# EAGLE design Rocket-Switch-Interface_1.0 (EAGLE 9.6.2)
AUTHOR: ladyada
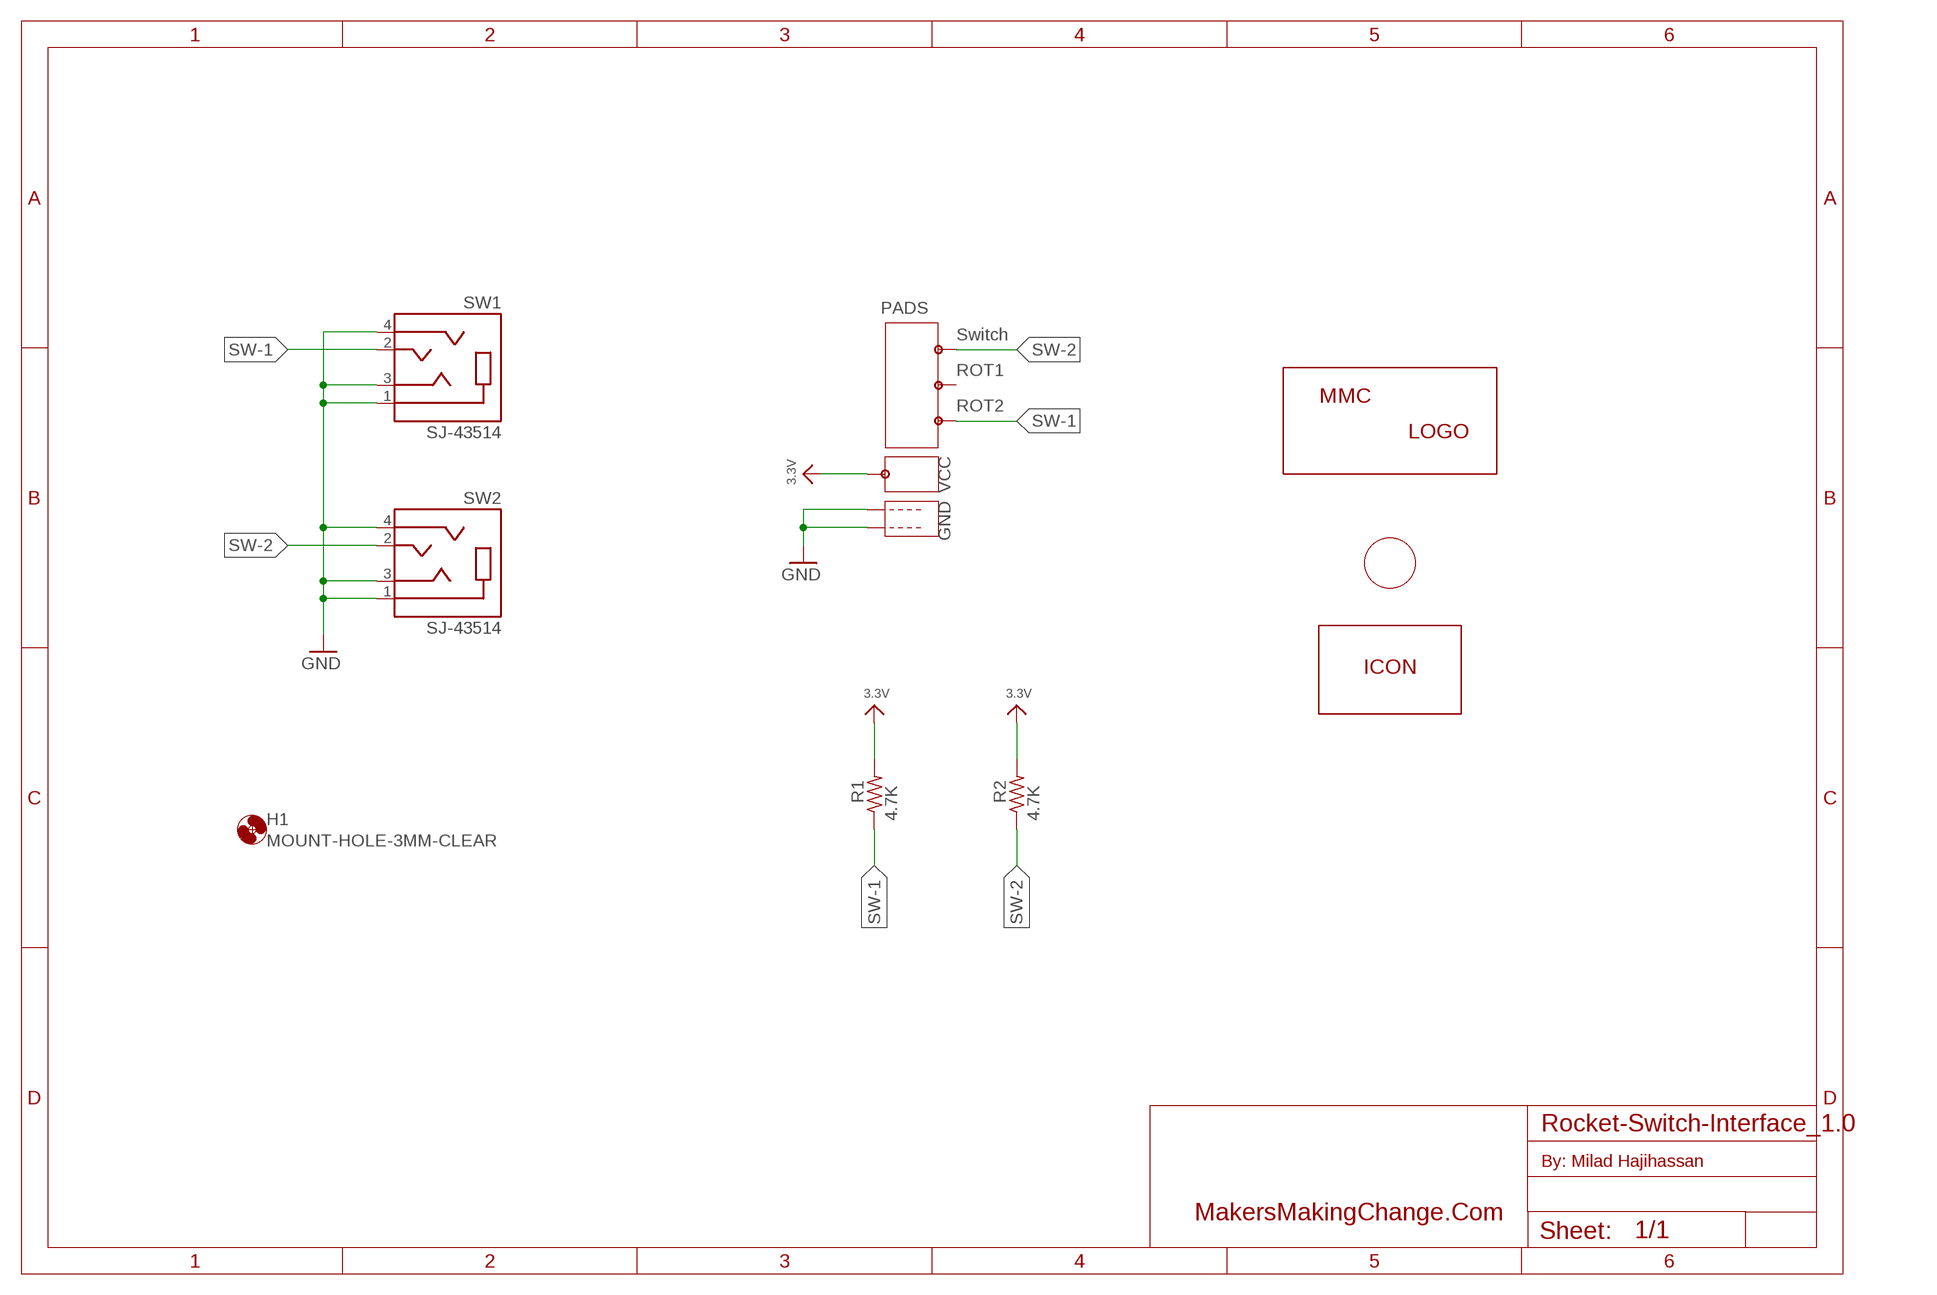
[diagram p0: schematic, sheet 1]

## Parts
H1  MOUNT-HOLE-3MM-CLEAR  [HOLE-3MM-CLEAR]
LABEL_BACKGROUND  MMC_ICON-ROCKET-SW  [ICON_ROCKET-SWITCH]
LABEL_DEVICE  MMC_LABEL-ROCKET-SW  [LABEL-ROCKET-SWITCH]
LABEL_LOGO  MMC_LOGO-XSM  [MMC_X-SMALL_LOGO]
PADS  PADS-ROTARY-TRINKEY  [PADS-ROTARY-TRINKEY]
R1  4.7K  RESISTOR-US-0204/5  [RESISTOR_0204/5]
R2  4.7K  RESISTOR-US-0204/5  [RESISTOR_0204/5]
SW1  SJ-43514  [CUI_SJ-43514]
SW2  SJ-43514  [CUI_SJ-43514]

## Nets
3.3V: PADS.P$VCC R1.2 R2.2
GND: PADS.P$GND1 PADS.P$GND2 SW1.1(SLEEVE) SW1.3(RING1) SW1.4(RING2) SW2.1(SLEEVE) SW2.3(RING1) SW2.4(RING2)
SW-1: PADS.P$ROT2 R1.1 SW1.2(TIP)
SW-2: PADS.P$SW R2.1 SW2.2(TIP)
Unconnected: PADS.P$ROT1

## Notes on the sheet
- By: Milad Hajihassan
- MakersMakingChange.Com

## Library data of the parts
H1 = MMC Eagle:MOUNT-HOLE-: MOUNTING HOLE with drill center marker
LABEL_BACKGROUND = MMC Eagle:MMC_ICON-
LABEL_DEVICE = MMC Eagle:MMC_LABEL-
LABEL_LOGO = MMC Eagle:MMC_LOGO-
PADS = MMC Eagle:PADS-ROTARY-TRINKEY: Rotary Encoder with Built-In Switch PEC11 - 24 Step, PEC11-4215F-S24 - http://www.adafruit.com/products/377
R1 R2 = MMC Eagle:RESISTOR-US-: RESISTOR, American symbol
SW1 SW2 = MMC Eagle:SJ-43514: SJ-43514 3.50mm (0.141", 1/8", Mini Plug) - Headphone Phone Jack Stereo (4 Conductor, TRRS) Connector. You can use these as jacks to connect analog joysticks or create simple switch interfaces. Options: Digikey - CP-43514-ND <https://www.digikey.ca/en/products/detail/cui-devices/SJ-43514/368146> Mouser - 490-SJ-43514 <https://www.mouser.ca/ProductDetail/CUI-Devices/SJ-43514?qs=WyjlAZoYn51bsBOfuwwiuw%3D%3D>

## Board
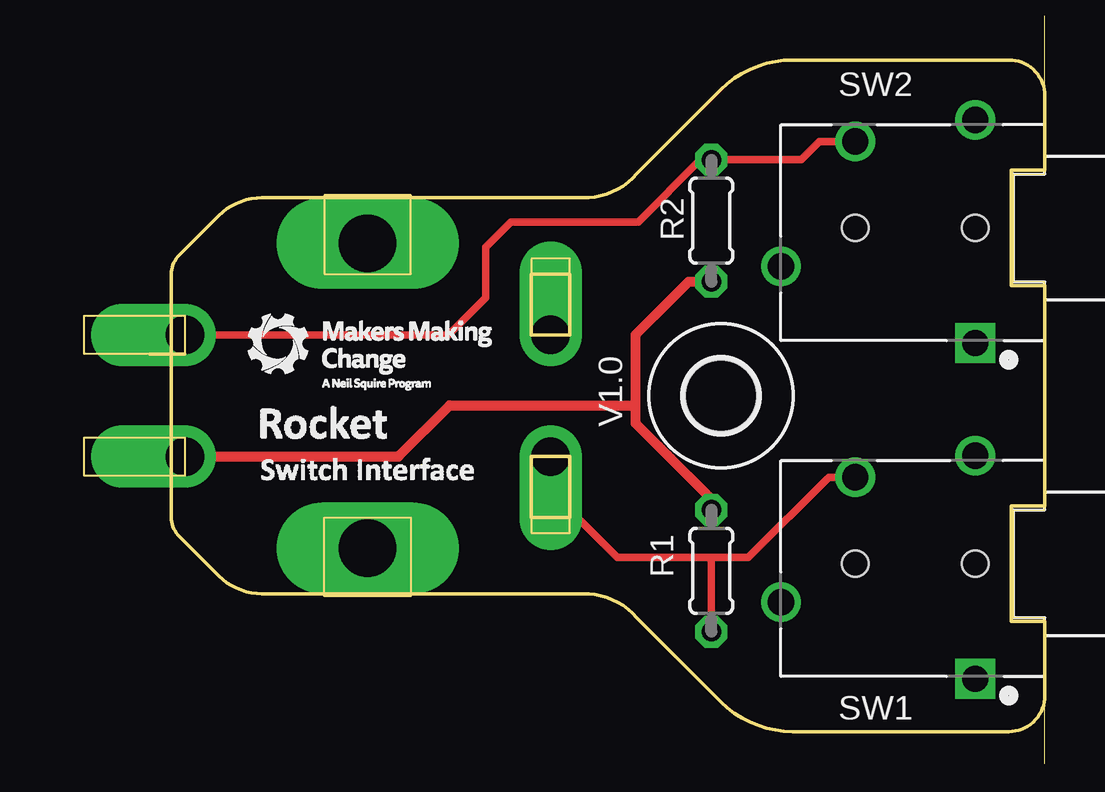
[diagram p1: board, top side]
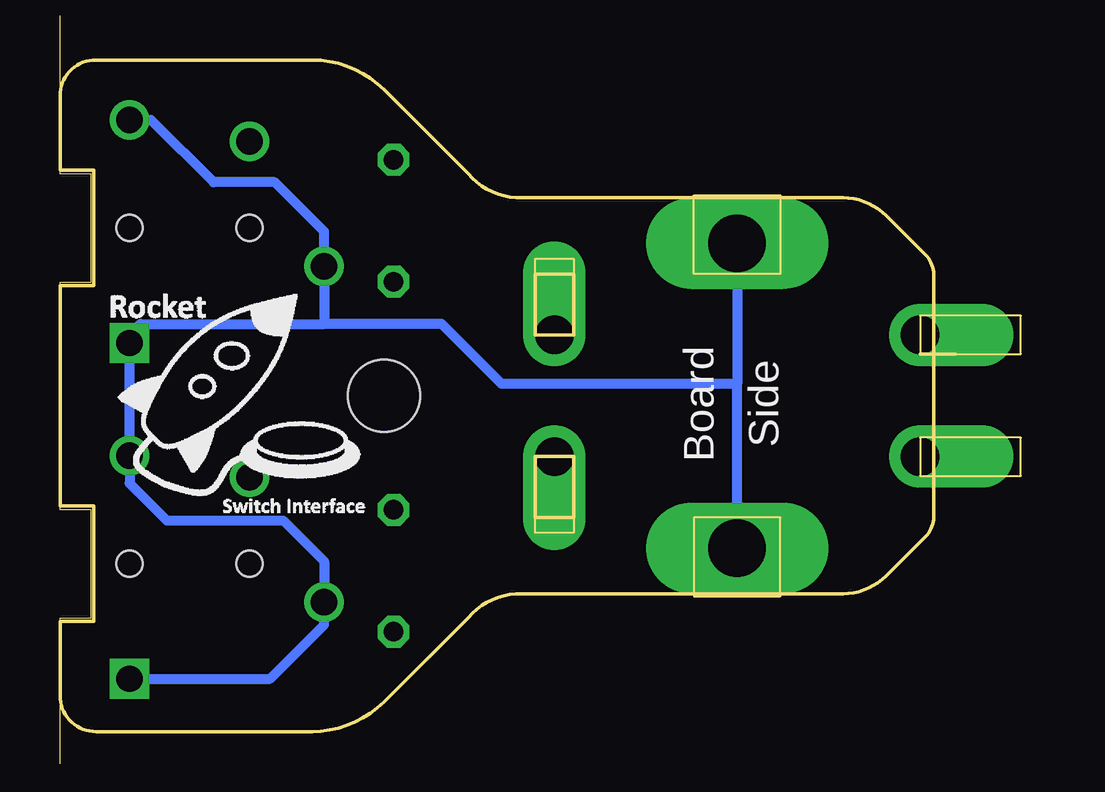
[diagram p2: board, bottom side, seen from below]

Size 37.3 x 28 mm. Coordinates in mm from the lower left corner, seen from the top.
Outline: 0,15.74 1.46,15.74
Outline: 1.17,19.8 1.4,20.03 2.88,21.51 arc-45 4.67,22.25 18.3,22.25 arc45 20.3,23.25 23.8,26.75 arc-45 26.8,28 35.8,28 arc-90 37.3,26.5 37.3,23.4 35.9,23.4 35.9,18.6 37.3,18.6 37.3,9.4 35.9,9.4 35.9,4.6 37.3,4.6 37.3,1.5 arc-90 35.8,0 26.8,0 arc-45 23.8,1.25 20.3,4.75 arc45 18.3,5.75 4.67,5.75 arc-45 2.88,6.49 1.4,7.97 1.17,8.2 arc-35 0.9,8.85 0.9,19.15 arc-35 1.17,19.8
Outline: 15.9,8.92 15.9,11.46 17.5,11.46 17.5,8.92 15.9,8.92
Outline: 15.9,16.54 15.9,19.08 17.5,19.08 17.5,16.54 15.9,16.54
Copper layers (1*16): Top 0.035mm / dielectric 1.5mm / Bottom 0.035mm
Design rules "adafruit 8-8 *": minimum track width 8mil, minimum drill 15.5mil, track to track 8mil, track to pad 8mil, pad to pad 8mil, via to via 8mil, smd to smd 8mil, copper to edge 10mil, drill to drill 8mil, minimum pad ring 10mil, minimum via ring 8mil, stop-mask expansion 2mil, vias tented up to drill 20mil, thermal gap 10mil

### Footprints (pad centres in the part's own frame; a part is rotated, then mirrored left to right if it is on the bottom)
HOLE-3MM-CLEAR = hole 3: 0,0
PADS-ROTARY-TRINKEY = drill 2.4 pad 3.8 long: P$GND1 -6.35,0; P$GND2 6.35,0 | drill 1.6 pad 2.6 offset: P$ROT1 2.54,-7.62; P$ROT2 -2.54,-7.62; P$SW 2.54,7.62; P$VCC -2.54,7.62
RESISTOR_0204/5 = drill 0.813 octagon: 1 -2.54,0; 2 2.54,0
CUI_SJ-43514 = drill 1.1 square: 1 -2.6,4.8 | drill 1.1: 2 2.4,-3.6; 3 5.5,1.6; 4 -2.6,-4.5 | hole 1.1: -2.6,0; 2.4,0

### Placement (x,y rotation side)
H1  23.8,14 0 top
LABEL_BACKGROUND  28.8,12.8 0 bottom
LABEL_DEVICE  8.8,11.5 0 top
LABEL_LOGO  9.08,14.25 0 top
PADS  9.08,14 90 top
R1  23.4,6.7 90 top
R2  23.4,21.3 270 top
SW1  31.8,7 180 top
SW2  31.8,21 180 top

### Tracks (layer width: path | path; a pad name or v marks a point on that pad's centre or on a via)
3.3V
  Top 0.406: PADS.P$VCC 10.36,11.46 12.5,13.6 20.25,13.6 | R2.2 22.46,18.76 20.25,16.55 20.25,13.6 | R1.2 23.4,9.7 20.25,12.85 20.25,13.6
GND
  Bottom 0.406: SW2.4 33.5,25.5 30.9,22.9 28.35,22.9 26.3,20.85 SW2.3 26.3,17 | SW1.1 28.55,2.2 26.3,4.45 SW1.3 26.3,7.1 28,8.8 32.85,8.8 34.4,10.35 SW1.4 SW2.1 34.4,16.55 33.95,17 26.3,17 | 26.3,17 21.4,17 18.9,14.5 9.08,14.5 | PADS.P$GND2 9.08,14.5 | PADS.P$GND1 9.08,14.5
SW-1
  Top 0.305: PADS.P$ROT2 16.7,10.04 19.49,7.25 23.45,7.25 | 23.45,7.25 24.95,7.25 28.29,10.6 SW1.2 | R1.1 23.4,7.2 23.45,7.25
SW-2
  Top 0.305: SW2.2 27.9,24.6 27.14,23.84 R2.1 22.94,23.84 20.35,21.25 15.05,21.25 14,20.2 14,18.1 12.44,16.54 PADS.P$SW

### Text on the board
tPlace: V1.0
bPlace: Side | Board